# EAGLE design shifts (EAGLE 7.4.0)
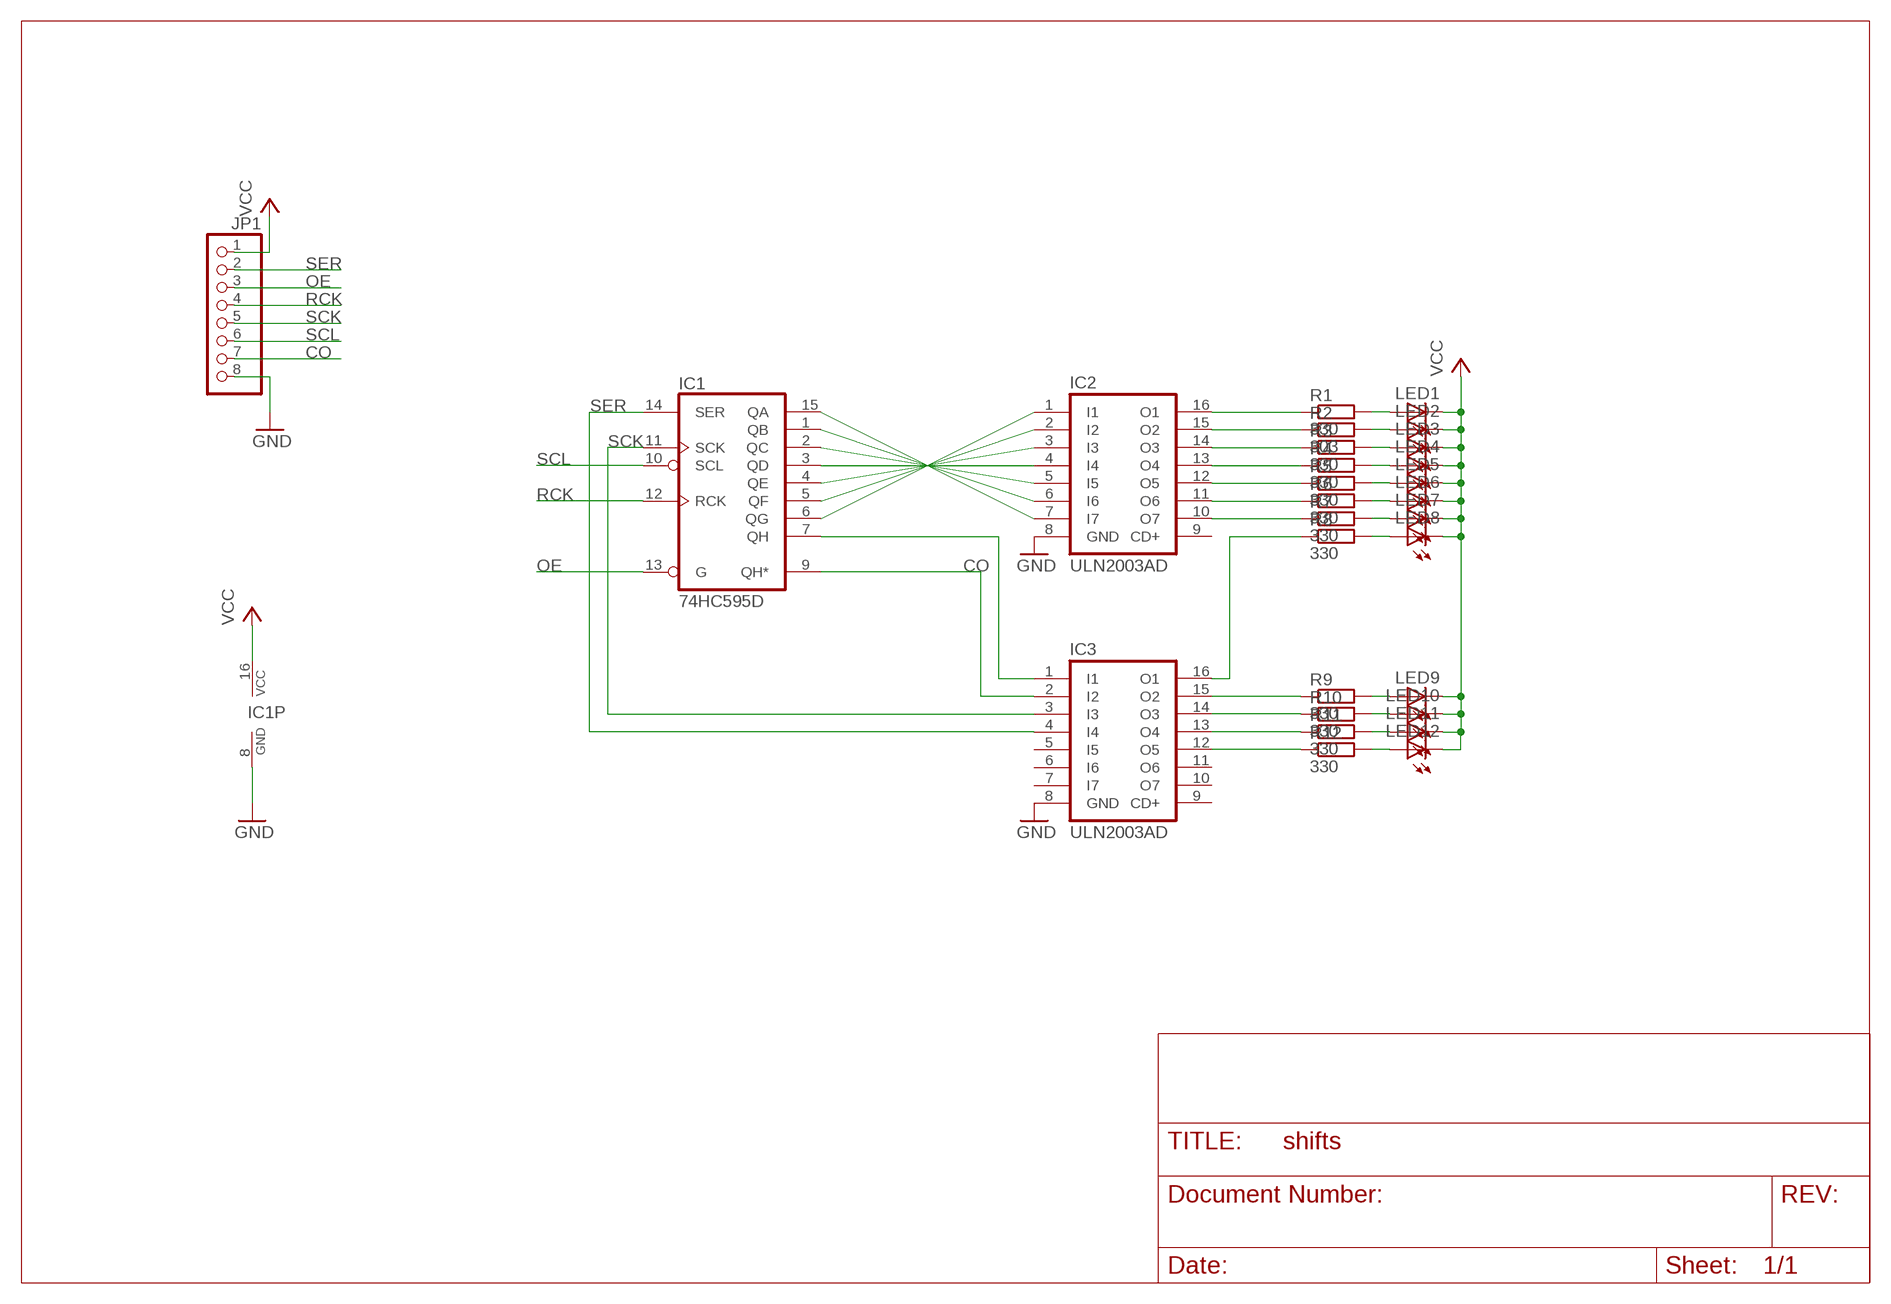
[diagram p0: schematic, sheet 1]

## Parts
IC1  74HC595D  [SO16]
IC2  ULN2003AD  [SO16]
IC3  ULN2003AD  [SO16]
JP1  PINHD-1X8BIG  [1X08-BIG]
LED1  LEDCHIP-LED0805  [CHIP-LED0805]
LED2  LEDCHIP-LED0805  [CHIP-LED0805]
LED3  LEDCHIP-LED0805  [CHIP-LED0805]
LED4  LEDCHIP-LED0805  [CHIP-LED0805]
LED5  LEDCHIP-LED0805  [CHIP-LED0805]
LED6  LEDCHIP-LED0805  [CHIP-LED0805]
LED7  LEDCHIP-LED0805  [CHIP-LED0805]
LED8  LEDCHIP-LED0805  [CHIP-LED0805]
LED9  LEDCHIP-LED0805  [CHIP-LED0805]
LED10  LEDCHIP-LED0805  [CHIP-LED0805]
LED11  LEDCHIP-LED0805  [CHIP-LED0805]
LED12  LEDCHIP-LED0805  [CHIP-LED0805]
R1  330  R-EU_R0805  [R0805]
R2  303  R-EU_R0805  [R0805]
R3  330  R-EU_R0805  [R0805]
R4  330  R-EU_R0805  [R0805]
R5  330  R-EU_R0805  [R0805]
R6  330  R-EU_R0805  [R0805]
R7  330  R-EU_R0805  [R0805]
R8  330  R-EU_R0805  [R0805]
R9  330  R-EU_R0805  [R0805]
R10  330  R-EU_R0805  [R0805]
R11  330  R-EU_R0805  [R0805]
R12  330  R-EU_R0805  [R0805]

## Nets
CO: IC1.9(QH*) IC3.2(I2) JP1.7
GND: IC1.8(GND) IC2.8(GND) IC3.8(GND) JP1.8
N$1: IC2.16(O1) R1.1
N$2: LED1.A R1.2
N$3: LED2.A R2.2
N$4: LED3.A R3.2
N$5: LED4.A R4.2
N$6: LED5.A R5.2
N$7: LED6.A R6.2
N$8: LED7.A R7.2
N$9: LED8.A R8.2
N$10: IC2.15(O2) R2.1
N$11: IC2.14(O3) R3.1
N$12: IC2.13(O4) R4.1
N$13: IC2.12(O5) R5.1
N$14: IC2.11(O6) R6.1
N$15: IC2.10(O7) R7.1
N$16: IC3.16(O1) R8.1
N$17: LED9.A R9.2
N$18: LED10.A R10.2
N$19: LED11.A R11.2
N$20: LED12.A R12.2
N$21: IC3.15(O2) R9.1
N$22: IC3.14(O3) R10.1
N$23: IC3.13(O4) R11.1
N$24: IC3.12(O5) R12.1
N$25: IC1.15(QA) IC2.7(I7)
N$26: IC1.1(QB) IC2.6(I6)
N$27: IC1.2(QC) IC2.5(I5)
N$28: IC1.3(QD) IC2.4(I4)
N$29: IC1.4(QE) IC2.3(I3)
N$30: IC1.5(QF) IC2.2(I2)
N$31: IC1.6(QG) IC2.1(I1)
N$32: IC1.7(QH) IC3.1(I1)
OE: IC1.13(G) JP1.3
RCK: IC1.12(RCK) JP1.4
SCK: IC1.11(SCK) IC3.3(I3) JP1.5
SCL: IC1.10(SCL) JP1.6
SER: IC1.14(SER) IC3.4(I4) JP1.2
VCC: IC1.16(VCC) JP1.1 LED1.C LED2.C LED3.C LED4.C LED5.C LED6.C LED7.C LED8.C LED9.C LED10.C LED11.C LED12.C
Unconnected: IC2.9(CD+) IC3.5(I5) IC3.6(I6) IC3.7(I7) IC3.9(CD+) IC3.10(O7) IC3.11(O6)

## Library data of the parts
IC1 = 74xx-eu:74*595: 8-bit SHIFT REGISTER, output latch
IC2 IC3 = uln-udn:ULN2003A: DRIVER ARRAY
JP1 = adafruit:PINHD-1X8: PIN HEADER
LED1-LED12 = adafruit:LED: LED OSRAM: - CHIPLED LG R971, LG N971, LY N971, LG Q971, LY Q971, LO R971, LY R971 LH N974, LH R974 LS Q976, LO Q976, LY Q976 LO Q996 - Hyper CHIPLED LW Q18S LB Q993, LB Q99A, LB R99A - SideLED LS A670, LO A670, LY A670, LG A670, LP A670 LB A673, LV A673, LT A673, LW A673 LH A674 LY A675 LS A676, LA A676, LO A676, LY A676, LW A676 LS A679, LY A679, LG A679 - Hyper Micro SIDELED® LS Y876, LA Y876, LO Y876, LY Y876 LT Y87S - SmartLED LW L88C, LW L88S LB L89C, LB L89S, LG L890 LS L89K, LO L89K, LY L89K LS L896, LA L896, LO L896, LY L896 - TOPLED LS T670, LO T670, LY T670, LG T670, LP T670 LSG T670, LSP T670, LSY T670, LOP T670, LYG T670 LG T671, LOG T671, LSG T671 LB T673, LV T673, LT T673, LW T673 LH T674 LS T676, LA T676, LO T676, LY T676, LB T676, LH T676, LSB T676, LW T676 LB T67C, LV T67C, LT T67C, LS T67K, LO T67K, LY T67K, LW E67C LS E67B, LA E67B, LO E67B, LY E67B, LB E67C, LV E67C, LT E67C LW T67C LS T679, LY T679, LG T679 LS T770, LO T770, LY T770, LG T770, LP T770 LB T773, LV T773, LT T773, LW T773 LH T774 LS E675, LA E675, LY E675, LS T675 LS T776, LA T776, LO T776, LY T776, LB T776 LHGB T686 LT T68C, LB T68C - Hyper Mini TOPLED® LB M676 - Mini TOPLED Santana® LG M470 LS M47K, LO M47K, LY M47K Source: http://www.osram.convergy.de/
R1-R12 = rcl:R-EU_: RESISTOR, European symbol

## Board
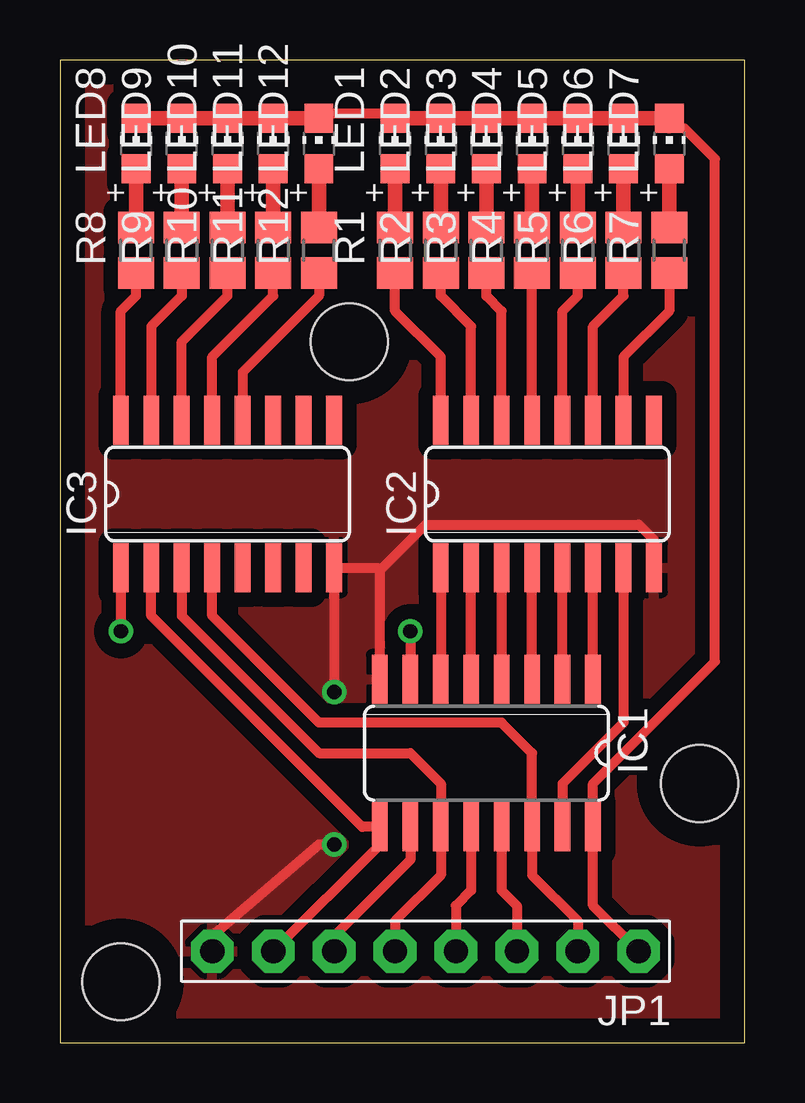
[diagram p1: board, top side]
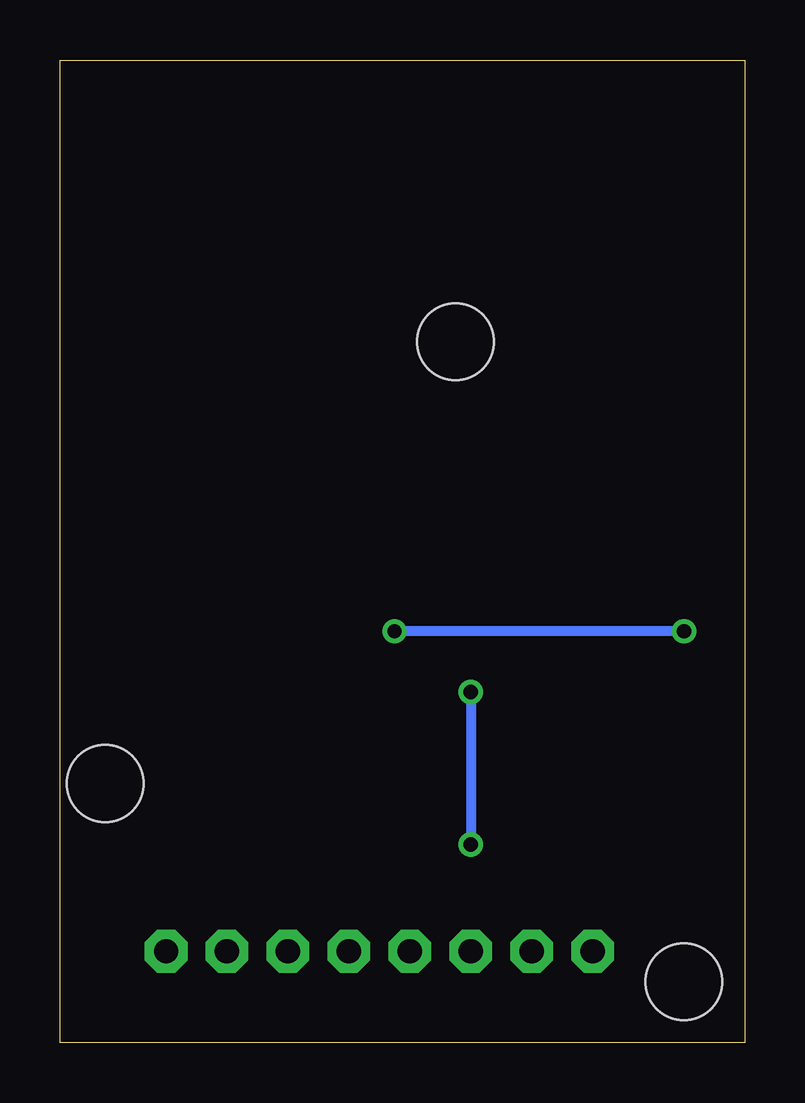
[diagram p2: board, bottom side, seen from below]

Size 28.55 x 40.95 mm. Coordinates in mm from the lower left corner, seen from the top.
Outline: 0,0 28.55,0 28.55,40.95 0,40.95 0,0
Copper layers (1*16): Top 0.035mm / dielectric 1.5mm / Bottom 0.035mm
Design rules "default": minimum track width 10mil, minimum drill 24mil, track to track 8mil, track to pad 8mil, pad to pad 8mil, via to via 8mil, smd to smd 8mil, copper to edge 40mil, drill to drill 8mil, minimum pad ring 10mil, minimum via ring 8mil, stop-mask expansion 4mil, vias tented up to drill 0mil, thermal gap 10mil
Holes 3.2 mm at 2.54,2.54 12.06,29.21 26.67,10.79

### Footprints (pad centres in the part's own frame; a part is rotated, then mirrored left to right if it is on the bottom)
SO16 = smd 0.66 x 2.032: 1 -4.445,-3.073; 2 -3.175,-3.073; 3 -1.905,-3.073; 4 -0.635,-3.073; 5 0.635,-3.073; 6 1.905,-3.073; 7 3.175,-3.073; 8 4.445,-3.073; 9 4.445,3.073; 10 3.175,3.073; 11 1.905,3.073; 12 0.635,3.073; 13 -0.635,3.073; 14 -1.905,3.073; 15 -3.175,3.073; 16 -4.445,3.073
1X08-BIG = drill 1.016 pad 1.778 octagon: 1 -8.89,0; 2 -6.35,0; 3 -3.81,0; 4 -1.27,0; 5 1.27,0; 6 3.81,0; 7 6.35,0; 8 8.89,0
CHIP-LED0805 = smd 1.2 x 1.2: A 0,-1.05; C 0,1.05
R0805 = smd 1.3 x 1.5: 1 -0.95,0; 2 0.95,0

### Placement (x,y rotation side)
IC1  17.78,12.06 180 top
IC2  20.32,22.86 0 top
IC3  6.99,22.86 0 top
JP1  15.24,3.81 180 top
LED1  13.97,37.47 0 top
LED2  15.88,37.47 0 top
LED3  17.78,37.47 0 top
LED4  19.68,37.47 0 top
LED5  21.59,37.47 0 top
LED6  23.5,37.47 0 top
LED7  25.4,37.47 0 top
LED8  3.17,37.47 0 top
LED9  5.08,37.47 0 top
LED10  6.99,37.47 0 top
LED11  8.89,37.47 0 top
LED12  10.79,37.47 0 top
R1  13.97,33.02 90 top
R2  15.88,33.02 90 top
R3  17.78,33.02 90 top
R4  19.68,33.02 90 top
R5  21.59,33.02 90 top
R6  23.5,33.02 90 top
R7  25.4,33.02 90 top
R8  3.17,33.02 90 top
R9  5.08,33.02 90 top
R10  6.99,33.02 90 top
R11  8.89,33.02 90 top
R12  10.79,33.02 90 top

### Tracks (layer width: path | path; a pad name or v marks a point on that pad's centre or on a via)
CO
  Top 0.406: IC3.2 3.81,17.78 12.6,8.99 IC1.9 13.34,8.26 JP1.7
GND  (via drill 0.6 pad 1.02)
  Top 0.406: IC1.8 13.34,19.68 | 13.34,19.68 15.24,21.59 24.13,21.59 24.77,20.95 IC2.8 | 13.34,19.68 13.23,19.79 IC3.8 v11.43,14.61 | v11.43,8.26 10.79,8.26 6.35,4.45 JP1.8
  Bottom 0.406: v11.43,14.61 v11.43,8.26
  pour Top (isolate 0.61): 0,40.64 28.57,40.64 28.57,0 0,0
N$1
  Top 0.406: IC2.16 15.88,28.57 13.97,30.48 R1.1
N$2
  Top 0.61: LED1.A R1.2
N$3
  Top 0.61: LED2.A R2.2
N$4
  Top 0.61: LED3.A R3.2
N$5
  Top 0.61: R4.2 LED4.A
N$6
  Top 0.61: LED5.A R5.2
N$7
  Top 0.61: LED6.A R6.2
N$8
  Top 0.61: R7.2 LED7.A
N$9
  Top 0.61: R8.2 LED8.A
N$10
  Top 0.406: IC2.15 17.14,29.84 15.88,31.11 R2.1
N$11
  Top 0.406: IC2.14 18.41,30.48 17.78,31.11 R3.1
N$12
  Top 0.406: IC2.13 R4.1
N$13
  Top 0.406: IC2.12 20.95,30.48 21.59,31.11 R5.1
N$14
  Top 0.406: IC2.11 22.23,29.84 23.5,31.11 R6.1
N$15
  Top 0.406: R7.1 25.4,30.48 23.5,28.57 IC2.10
N$16
  Top 0.406: IC3.16 2.54,30.48 3.17,31.11 R8.1
N$17
  Top 0.61: R9.2 LED9.A
N$18
  Top 0.61: R10.2 LED10.A
N$19
  Top 0.61: R11.2 LED11.A
N$20
  Top 0.61: LED12.A R12.2
N$21
  Top 0.406: R9.1 5.08,31.11 3.81,29.84 IC3.15
N$22
  Top 0.406: IC3.14 5.08,29.21 6.99,31.11 R10.1
N$23
  Top 0.406: IC3.13 6.35,28.57 8.89,31.11 R11.1
N$24
  Top 0.406: R12.1 10.79,31.11 7.62,27.94 IC3.12
N$25
  Top 0.406: IC2.7 23.5,13.34 20.95,10.79 IC1.15
N$26
  Top 0.406: IC1.1 IC2.6
N$27
  Top 0.406: IC1.2 IC2.5
N$28
  Top 0.406: IC1.3 IC2.4
N$29
  Top 0.406: IC2.3 IC1.4
N$30
  Top 0.406: IC1.5 IC2.2
N$31
  Top 0.406: IC2.1 IC1.6
N$32  (via drill 0.6 pad 1.02)
  Top 0.406: IC3.1 v2.54,17.14 | v14.61,17.14 IC1.7
  Bottom 0.406: v2.54,17.14 v14.61,17.14
OE
  Top 0.406: JP1.3 19.05,5.71 18.41,6.35 IC1.13
RCK
  Top 0.406: JP1.4 16.51,5.71 17.14,6.35 IC1.12
SCK
  Top 0.406: IC3.3 5.08,17.78 10.79,12.06 14.61,12.06 15.88,10.79 IC1.11 15.88,6.99 13.97,5.08 JP1.5
SCL
  Top 0.406: IC1.10 14.61,7.62 11.43,4.45 JP1.6
SER
  Top 0.406: IC3.4 6.35,17.78 10.79,13.34 18.41,13.34 19.68,12.06 IC1.14 19.68,6.99 21.59,5.08 JP1.2
VCC
  Top 0.406: LED7.C 25.4,38.1 26.04,38.1 27.3,36.83 27.3,15.88 22.23,10.79 IC1.16 22.23,5.71 JP1.1 | LED1.C 13.97,38.73 10.79,38.73 LED12.C
  Top 0.61: LED1.C LED2.C LED3.C LED4.C LED5.C LED6.C LED7.C | LED8.C LED9.C LED10.C LED11.C LED12.C